# Altium schematic sheet SC_Integrador.SchDoc
size A4
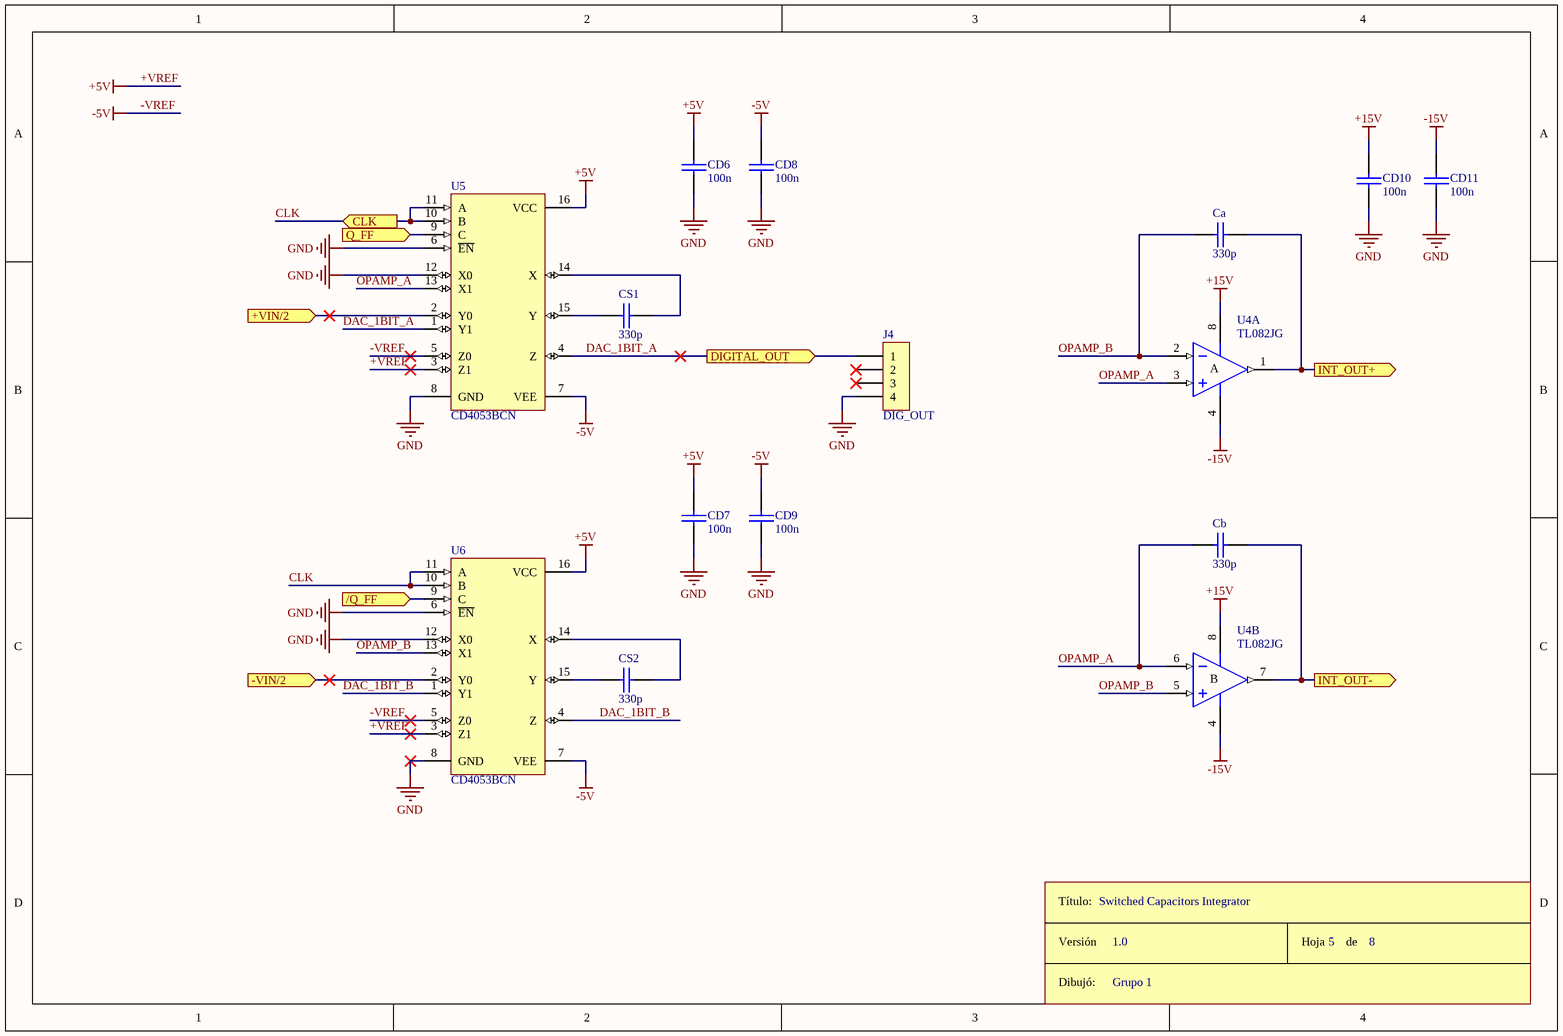
[diagram p0: SC_Integrador.SchDoc]

## Parts
Ca  330p  [CAP100]
Cb  330p  [CAP100]
CD6  100n  [CAP100]
CD7  100n  [CAP100]
CD8  100n  [CAP100]
CD9  100n  [CAP100]
CD10  100n  [CAP100]
CD11  100n  [CAP100]
CS1  330p  [CAP100]
CS2  330p  [CAP100]
J4  DIG_OUT  [SIP4]
ROT4  Rótulo  (value not drawn)
U4  TL082JG  [JG008]  (parts A,B of 2)
U5  CD4053BCN  [N16E]
U6  CD4053BCN  [N16E]

## Ports
+VIN/2 (in), -VIN/2 (in), /Q_FF (in), CLK (in), DIGITAL_OUT (out), INT_OUT+ (out), INT_OUT- (out), Q_FF (in)

## Nets
+15V: CD10.1 U4.8(V+)
+VREF: CD6.1 CD7.1 U5.3(Z1) U5.16(VCC) U6.3(Z1) U6.16(VCC)  [also labelled +5V]
-15V: CD11.1 U4.4(V-)
-VREF: CD8.1 CD9.1 U5.5(Z0) U5.7(VEE) U6.5(Z0) U6.7(VEE)  [also labelled -5V]
GND: CD6.2 CD7.2 CD8.2 CD9.2 CD10.2 CD11.2 J4.4 U5.6(~{EN}) U5.8(GND) U5.12(X0) U6.6(~{EN}) U6.8(GND) U6.12(X0)
+VIN/2: U5.2(Y0) ; port +VIN/2
-VIN/2: U6.2(Y0) ; port -VIN/2
/Q_FF: U6.9(C) ; port /Q_FF
CLK: U5.10(B) U5.11(A) U6.10(B) U6.11(A) ; port CLK
DAC_1BIT_A: J4.1 U5.1(Y1) U5.4(Z) ; port DIGITAL_OUT
DAC_1BIT_B: U6.1(Y1) U6.4(Z)
INT_OUT+: Ca.2 U4.1(OUT) ; port INT_OUT+
INT_OUT-: Cb.2 U4.7(OUT) ; port INT_OUT-
OPAMP_A: Cb.1 U4.3(IN+) U4.6(IN-) U5.13(X1)
OPAMP_B: Ca.1 U4.2(IN-) U4.5(IN+) U6.13(X1)
Q_FF: U5.9(C) ; port Q_FF
NetCS1_1: CS1.1 U5.14(X)
NetCS1_2: CS1.2 U5.15(Y)
NetCS2_1: CS2.1 U6.15(Y)
NetCS2_2: CS2.2 U6.14(X)

Not connected (* = marked no-connect by the designer): J4 2* 3*

## Notes on the sheet
- Switched Capacitors Integrator
- 1.0
- Grupo 1
- 5
- 8
- (in symbol Rótulo) Título:; Versión; Hoja       de; Dibujó:
- (in symbol TL082JG, part A) A
- (in symbol TL082JG, part B) B

## Library data of the parts
Ca Cb CD6-CD11 CS1 CS2 = CAP
J4 = CON4
U4 = TL082JG: JFET-Input Operational Amplifier; Published: 16-Jan-2001; LatestRevisionDate: 04-Mar-2005; LatestRevisionNote: Stylized 3D Model Added.; DatasheetVersion: Feb-1999; PackageVersion: Jan-1995; PackageReference: JG008; Publisher: Altium Limited; PackageDescription: DIP; 8 Leads; Row Spacing 7.62 mm; Pitch 2.54 mm; ComponentLink1Description: Manufacturer Link; ComponentLink1URL: http://www.ti.com/; ComponentLink2Description: Datasheet; ComponentLink2URL: http://www-s.ti.com/sc/ds/tl082.pdf
U5 U6 = CD4053BCN: Triple 2-Channnel Analog Multiplexer/Demutiplexer; Published: 17-Jul-2002; LatestRevisionDate: 29-May-2009; LatestRevisionNote: Component Body Added.; DatasheetVersion: Jan-1999; PackageVersion: 2000; PackageReference: N16E; Publisher: Altium Limited; PackageDescription: DIP, 16-Pin, Row Spacing 7.62 mm, Pitch 2.54 mm; ComponentLink1Description: Manufacturer Link; ComponentLink1URL: http://www.fairchildsemi.com/; ComponentLink2Description: Datasheet; ComponentLink2URL: http://www.fairchildsemi.com/ds/CD%2FCD4052BC.pdf